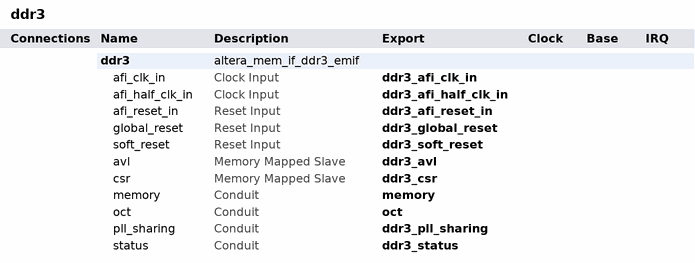
[diagram p0: system contents]
# Platform Designer (Qsys) system ddr3, Arria V 5AGTFC7H3F35I3
# Parameters at their usual value, and those the tool derives, are not listed.
package require -exact qsys 21.1
create_system ddr3
set_project_property DEVICE_FAMILY {Arria V}
set_project_property DEVICE 5AGTFC7H3F35I3

add_instance ddr3 altera_mem_if_ddr3_emif 21.1
set_instance_parameter_value ddr3 AVL_MAX_SIZE 4
set_instance_parameter_value ddr3 CALIBRATION_MODE Skip
set_instance_parameter_value ddr3 CPORT_TYPE_PORT Bidirectional,Bidirectional,Bidirectional,Bidirectional,Bidirectional,Bidirectional
set_instance_parameter_value ddr3 CTL_CSR_CONNECTION EXPORT
set_instance_parameter_value ddr3 CTL_CSR_ENABLED true
set_instance_parameter_value ddr3 EXPORT_AFI_HALF_CLK false
set_instance_parameter_value ddr3 HARD_EMIF false
set_instance_parameter_value ddr3 MEM_ASR Automatic
set_instance_parameter_value ddr3 MEM_BANKADDR_WIDTH 3
set_instance_parameter_value ddr3 MEM_CLK_FREQ 533.33
set_instance_parameter_value ddr3 MEM_CLK_FREQ_MAX 533.333
set_instance_parameter_value ddr3 MEM_COL_ADDR_WIDTH 10
set_instance_parameter_value ddr3 MEM_DQ_WIDTH 64
set_instance_parameter_value ddr3 MEM_DRV_STR RZQ/6
set_instance_parameter_value ddr3 MEM_FORMAT DISCRETE
set_instance_parameter_value ddr3 MEM_ROW_ADDR_WIDTH 14
set_instance_parameter_value ddr3 MEM_TCL 7
set_instance_parameter_value ddr3 MEM_TFAW_NS 37.5
set_instance_parameter_value ddr3 MEM_TRAS_NS 37.5
set_instance_parameter_value ddr3 MEM_TRCD_NS 13.125
set_instance_parameter_value ddr3 MEM_TRFC_NS 110.0
set_instance_parameter_value ddr3 MEM_TRP_NS 13.125
set_instance_parameter_value ddr3 MEM_TRRD_NS 13.2
set_instance_parameter_value ddr3 MEM_TRTP_NS 13.2
set_instance_parameter_value ddr3 MEM_TWTR 4
set_instance_parameter_value ddr3 MEM_VENDOR Micron
set_instance_parameter_value ddr3 MEM_WTCL 7
set_instance_parameter_value ddr3 PLL_LOCATION Top_Bottom
set_instance_parameter_value ddr3 PLL_SHARING_MODE Slave
set_instance_parameter_value ddr3 POWER_OF_TWO_BUS false
set_instance_parameter_value ddr3 PRIORITY_PORT 1,1,1,1,1,1
set_instance_parameter_value ddr3 RATE Half
set_instance_parameter_value ddr3 REF_CLK_FREQ 125.0
set_instance_parameter_value ddr3 SPEED_GRADE 3
set_instance_parameter_value ddr3 TIMING_BOARD_AC_SKEW 0.02
set_instance_parameter_value ddr3 TIMING_BOARD_AC_TO_CK_SKEW 0.0
set_instance_parameter_value ddr3 TIMING_BOARD_DQ_TO_DQS_SKEW 0.0
set_instance_parameter_value ddr3 TIMING_BOARD_MAX_CK_DELAY 0.6
set_instance_parameter_value ddr3 TIMING_BOARD_MAX_DQS_DELAY 0.6
set_instance_parameter_value ddr3 TIMING_BOARD_SKEW_BETWEEN_DQS 0.02
set_instance_parameter_value ddr3 TIMING_BOARD_SKEW_CKDQS_DIMM_MAX 0.01
set_instance_parameter_value ddr3 TIMING_BOARD_SKEW_CKDQS_DIMM_MIN -0.01
set_instance_parameter_value ddr3 TIMING_BOARD_SKEW_WITHIN_DQS 0.02
set_instance_parameter_value ddr3 TIMING_TDH 100
set_instance_parameter_value ddr3 TIMING_TDQSCK 300
set_instance_parameter_value ddr3 TIMING_TDQSQ 150
set_instance_parameter_value ddr3 TIMING_TDQSS 0.25
set_instance_parameter_value ddr3 TIMING_TDS 25
set_instance_parameter_value ddr3 TIMING_TDSH 0.2
set_instance_parameter_value ddr3 TIMING_TDSS 0.2
set_instance_parameter_value ddr3 TIMING_TIH 200
set_instance_parameter_value ddr3 TIMING_TIS 125
set_instance_parameter_value ddr3 TIMING_TQSH 0.38
set_instance_parameter_value ddr3 USER_DEBUG_LEVEL 0

# exported interfaces
add_interface ddr3_afi_clk_in clock sink
set_interface_property ddr3_afi_clk_in EXPORT_OF ddr3.afi_clk_in
add_interface ddr3_afi_half_clk_in clock sink
set_interface_property ddr3_afi_half_clk_in EXPORT_OF ddr3.afi_half_clk_in
add_interface ddr3_afi_reset_in reset sink
set_interface_property ddr3_afi_reset_in EXPORT_OF ddr3.afi_reset_in
add_interface ddr3_avl avalon slave
set_interface_property ddr3_avl EXPORT_OF ddr3.avl
add_interface ddr3_csr avalon slave
set_interface_property ddr3_csr EXPORT_OF ddr3.csr
add_interface ddr3_global_reset reset sink
set_interface_property ddr3_global_reset EXPORT_OF ddr3.global_reset
add_interface ddr3_pll_sharing conduit end
set_interface_property ddr3_pll_sharing EXPORT_OF ddr3.pll_sharing
add_interface ddr3_soft_reset reset sink
set_interface_property ddr3_soft_reset EXPORT_OF ddr3.soft_reset
add_interface ddr3_status conduit end
set_interface_property ddr3_status EXPORT_OF ddr3.status
add_interface memory conduit end
set_interface_property memory EXPORT_OF ddr3.memory
add_interface oct conduit end
set_interface_property oct EXPORT_OF ddr3.oct

set_interconnect_requirement {$system} qsys_mm.clockCrossingAdapter HANDSHAKE
set_interconnect_requirement {$system} qsys_mm.enableEccProtection FALSE
set_interconnect_requirement {$system} qsys_mm.insertDefaultSlave FALSE
set_interconnect_requirement {$system} qsys_mm.maxAdditionalLatency 1

save_system ddr3.qsys
